# Altium schematic sheet Power.SchDoc
size A
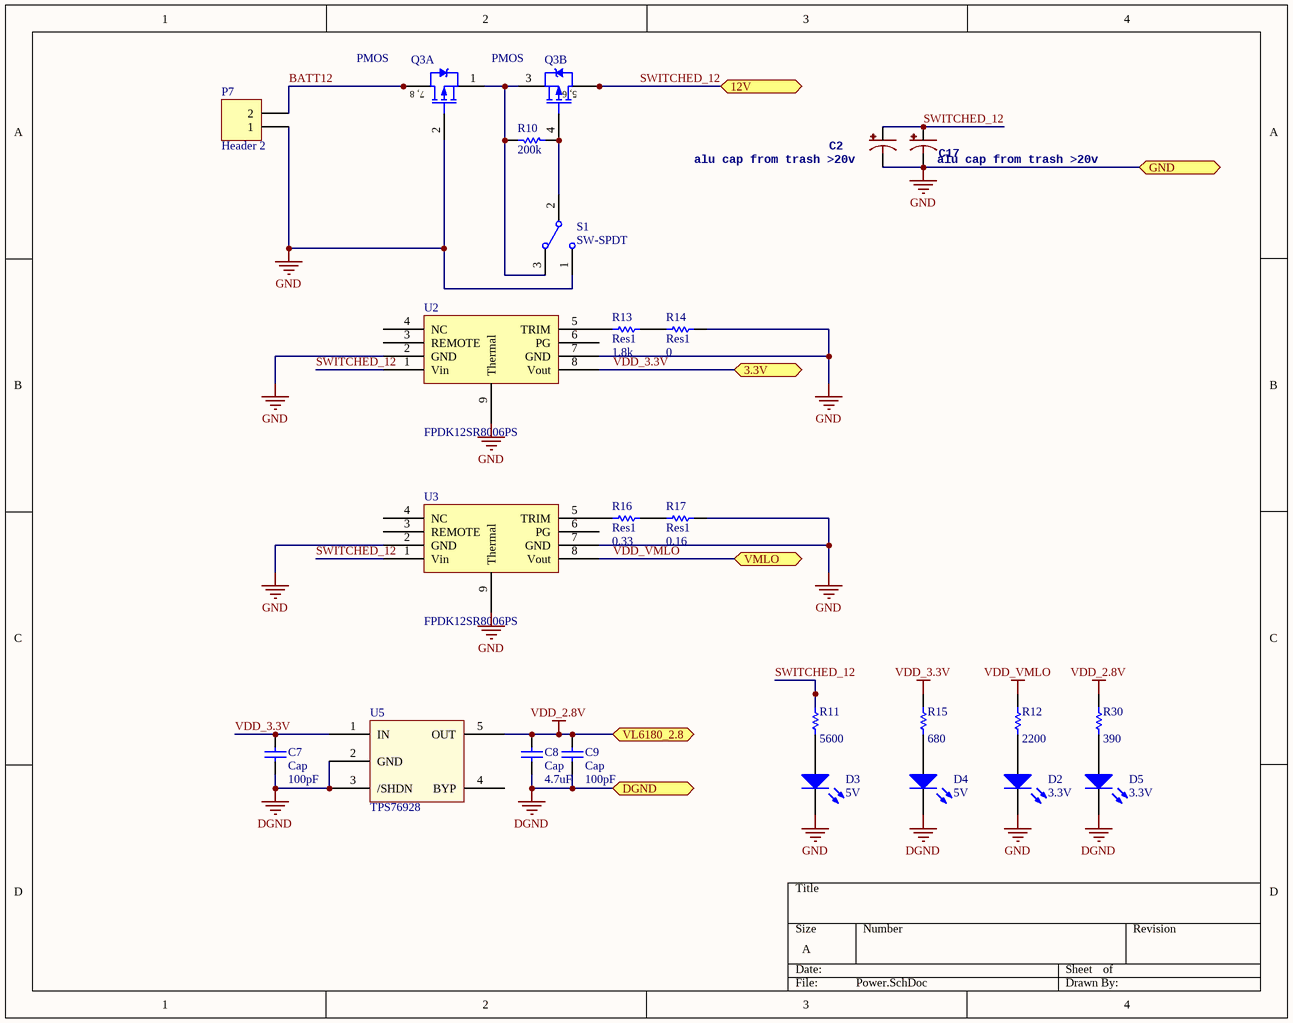
[diagram p0: Power.SchDoc]

## Parts
C2  alu cap from trash >20v  [PANASONIC_D]
C7  Cap  value 100pF  [CAP_0805]
C8  Cap  value 4.7uF  [CAP_0805]
C9  Cap  value 100pF  [CAP_0805]
C17  alu cap from trash >20v  [PANASONIC_D]
D2  3.3V  [LED_0805_GREEN]
D3  5V  [LED_0805_GREEN]
D4  5V  [LED_0805_GREEN]
D5  3.3V  [LED_0805_GREEN]
P7  Header 2  [HX2.54-2]
Q3  PMOS  [SOIC_E200_8]  (parts A,B of 2)
R10  value 200k  [RES_0805]  (hidden comment: Res)
R11  value 5600  [RES_0805]  (hidden comment: Res)
R12  value 2200  [RES_0805]  (hidden comment: Res)
R13  Res1  value 1.8k  [RES_0805]
R14  Res1  value 0  [RES_0805]
R15  value 680  [RES_0805]  (hidden comment: Res)
R16  Res1  value 0.33  [RES_0805]
R17  Res1  value 0.16  [RES_0805]
R30  value 390  [RES_0805]  (hidden comment: Res)
S1  SW-SPDT  [G3T-12AH]
U2  FPDK12SR8006PS  [FPDK12SR8006]
U3  FPDK12SR8006PS  [FPDK12SR8006]
U5  TPS76928  [SOT23-5]

## Ports
3.3V, 12V, DGND, GND, VL6180_2.8, VMLO

## Nets
DGND: C7.1 C8.1 C9.1 D4.2(K) D5.2(K) U5.2(GND) U5.3(/SHDN) ; port DGND
GND: C2.- C17.- D2.2(K) D3.2(K) P7.1 Q3.2(G) R14.2 R17.2 S1.1 U2.2(GND) U2.7(GND) U2.9(Thermal) U3.2(GND) U3.7(GND) U3.9(Thermal) ; port GND
VDD_2.8V: C8.2 C9.2 R30.2 U5.5(OUT) ; port VL6180_2.8
VDD_3.3V: C7.2 R15.2 U2.8(Vout) U5.1(IN) ; port 3.3V
VDD_VMLO: R12.2 U3.8(Vout) ; port VMLO
BATT12: P7.2 Q3.7(D) Q3.8(D)
SWITCHED_12: C2.+ C17.+ Q3.5(D) Q3.6(D) R11.2 U2.1(Vin) U3.1(Vin) ; port 12V
NetD2_1: D2.1(A) R12.1
NetD3_1: D3.1(A) R11.1
NetD4_1: D4.1(A) R15.1
NetD5_1: D5.1(A) R30.1
NetQ3_1: Q3.1(S) Q3.3(S) R10.1 S1.3
NetQ3_4: Q3.4(G) R10.2 S1.2
NetR13_1: R13.1 U2.5(TRIM)
NetR13_2: R13.2 R14.1
NetR16_1: R16.1 U3.5(TRIM)
NetR16_2: R16.2 R17.1

Not connected (* = marked no-connect by the designer): U2 3(REMOTE) 4(NC) 6(PG); U3 3(REMOTE) 4(NC) 6(PG); U5 4(BYP)

## Notes on the sheet
- (in symbol IRF7316, part A) 7, 8
- (in symbol IRF7316, part B) 5, 6

## Library data of the parts
C2 C17 = CAP_POLD
C7-C9 = Cap: Capacitor; Published: 8-Jun-2000; LatestRevisionDate: 17-Jul-2002; LatestRevisionNote: Re-released for DXP Platform.; PackageReference: RAD-0.3; Publisher: Altium Limited; PackageDescription: Radial Cap, Thru-Hole; 2 Leads; 0.3 in Pin Spacing
D2-D5 = LED0: LED 1206 green; Published: 8-Jun-2000; LatestRevisionDate: 08-Jul-2005; LatestRevisionNote: Mech Layer 1 removed.; PackageReference: LED-0; Publisher: Altium Limited
P7 = Header 2: Header, 2-Pin; LatestRevisionDate: 17-Jul-2002; LatestRevisionNote: Re-released for DXP Platform.; Publisher: Altium Limited
Q3 = IRF7316: Dual PMOS; Published: 8-Jun-2000; LatestRevisionDate: 13-Apr-2006; LatestRevisionNote: IPC-7351 Footprint Added.; DatasheetVersion: Aug-1997; PackageVersion: Feb-2001; PackageReference: SO-8; Publisher: Altium Limited; PackageDescription: 8-Pin Plastic Small Outline Integrated Circuit 1.27 mm Pitch; Code_JEDEC: MS-012-AA; Code_IPC: SOIC127P600-8; ComponentLink1Description: Manufacturer Link; ComponentLink1URL: http://www.irf.com/; ComponentLink2Description: Datasheet; ComponentLink2URL: http://www.irf.com/product-info/datasheets/data/irf7316.pdf
R10-R17 R30 = Res1: Resistor; Published: 8-Jun-2000; LatestRevisionDate: 17-Jul-2002; LatestRevisionNote: Re-released for DXP Platform.; PackageReference: AXIAL-0.3; Publisher: Altium Limited
  R13 R14 R16 R17: PackageDescription: Axial Device, Thru-Hole; 2 Leads; 0.3 in Pin Spacing
S1 = SW-SPDT: SPDT Subminiature Toggle Switch, Right Angle Mounting, Vertical Actuation; Published: 24-Mar-1999; LatestRevisionDate: 17-Dec-2003; LatestRevisionNote: Schematic revised, PCB Footprint replaced.; DatasheetVersion: 05-Dec-2000; PackageReference: TL36WW15050; Publisher: Altium Limited; PackageDescription: Switch; 4 Leads; ComponentLink1Description: Manufacturer Link; ComponentLink1URL: http://www.apem.com